# EAGLE design mqtt-LightbulbwithtempandIR (EAGLE 9.6.2)
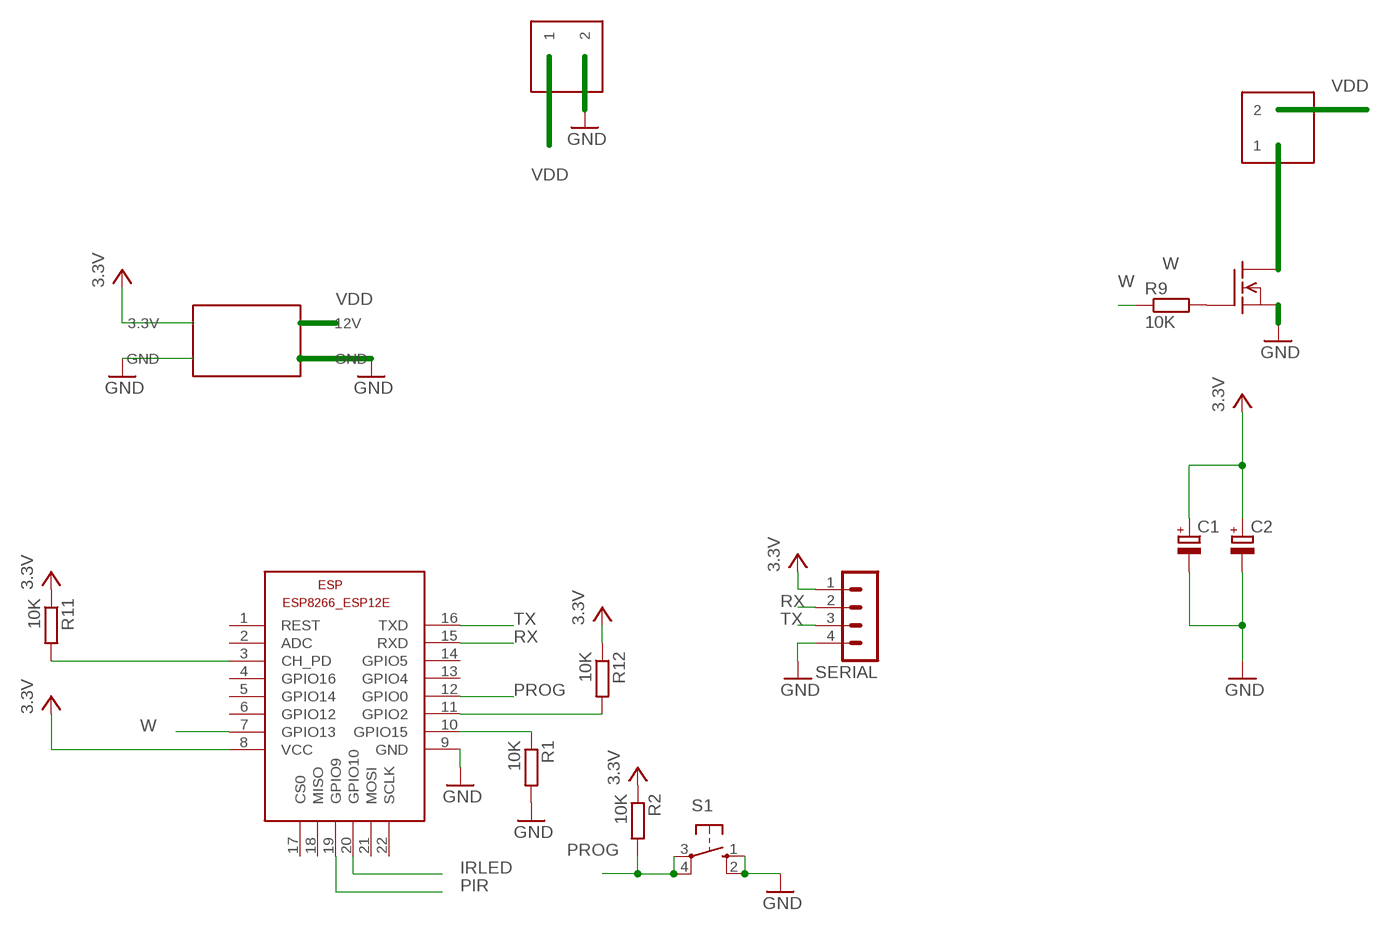
[diagram p0: schematic, sheet 1]

## Parts
C1  CPOL-EUE2-5  [E2-5]
C2  CPOL-EUE2-5  [E2-5]
ESP  ESP8266-12EESP8266-ESP12E  [ESP8266-ESP12E]
PWR1  MP2307-MINI-360  [MP2307-MINI-360]
PWR_IN1  KF350-P2  [KF350-2P]
PWR_IN2  KF350-P2  [KF350-2P]
R1  10K  R-EU_R0603  [R0603]
R2  10K  R-EU_R0603  [R0603]
R9  10K  R-EU_R0603  [R0603]
R11  10K  R-EU_R0603  [R0603]
R12  10K  R-EU_R0603  [R0603]
S1  10-XX  [B3F-10XX]
SERIAL  MA04-1  [MA04-1]
W  FDS5680  [SO-8]

## Nets
DW: PWR_IN1.1 W.5(D) W.6(D) W.7(D) W.8(D)
GND: C1.- C2.- ESP.9(GND) PWR1.GND@1(GND) PWR1.GND@2(GND) PWR_IN2.2 R1.2 S1.1(S) S1.2(S1) SERIAL.4 W.1(S) W.2(S) W.3(S)
IRLED: ESP.20(GPIO10)
N$2: ESP.10(GPIO15) R1.1
N$3: ESP.3(CH_PD) R11.2
N$4: ESP.11(GPIO2) R12.2
N$13: R9.2 W.4(G)
PIR: ESP.19(GPIO9)
PROG: ESP.12(GPIO0) R2.2 S1.3(P) S1.4(P1)
RX: ESP.15(RXD) SERIAL.2
TX: ESP.16(TXD) SERIAL.3
VCC: C1.+ C2.+ ESP.8(VCC) PWR1.3.3V R2.1 R11.1 R12.1 SERIAL.1 ; supply symbol labelled 3.3V
VDD: PWR1.12V PWR_IN1.2 PWR_IN2.1
W: ESP.7(GPIO13) R9.1
Unconnected: ESP.1(REST) ESP.2(ADC) ESP.4(GPIO16) ESP.5(GPIO14) ESP.6(GPIO12) ESP.13(GPIO4) ESP.14(GPIO5) ESP.17(CS0) ESP.18(MISO) ESP.21(MOSI) ESP.22(SCLK)

## Library data of the parts
C1 C2 = resistor:CPOL-EU: POLARIZED CAPACITOR, European symbol
ESP = ESP8266-ESP12E:ESP8266-12E: ESP8266-12E with additional I/O and GPIO04/05 corrected The author cannot warrant that this library is free from error or will meet your specific requirements. Created by PuceBaboon.com. Komagane, Nagano, JAPAN
PWR1 = MP2307-MINI-360:MP2307-MINI-360
PWR_IN1 PWR_IN2 = KF350-P2:KF350-P2
R1 R2 R9 R11 R12 = resistor:R-EU_: RESISTOR, European symbol
S1 = switch-omron:10-XX: OMRON SWITCH; MPN: B3F-1000; OC_FARNELL: 176432; OC_NEWARK: 36M3542
SERIAL = con-lstb:MA04-1: PIN HEADER; OC_FARNELL: unknown; OC_NEWARK: unknown
W = transistor-fet:FDS5680: 60V N-Channel PowerTrench TM MOSFET FAIRCHILD FDS5680.pdf

## Board
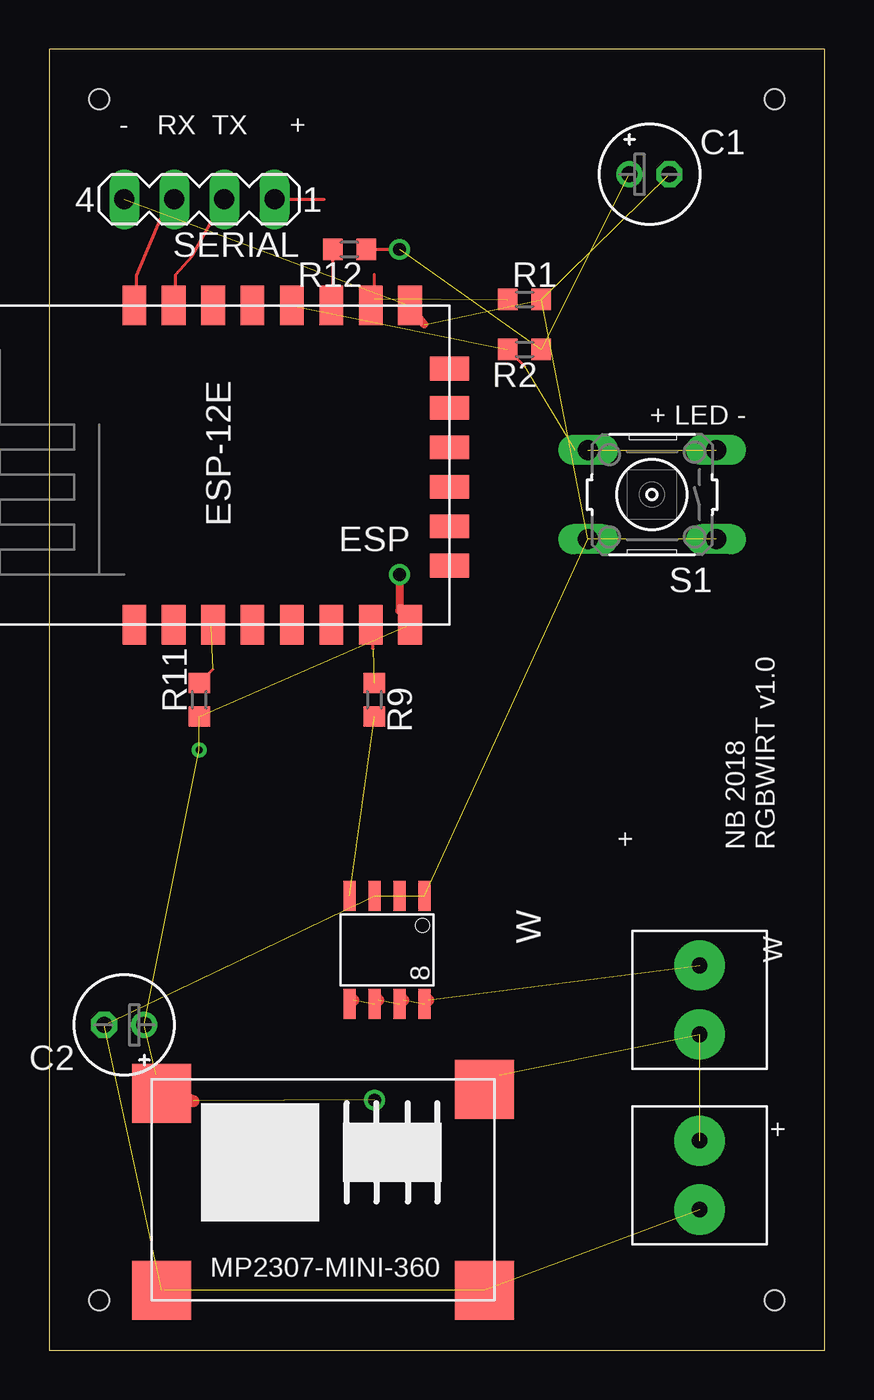
[diagram p1: board, top side]
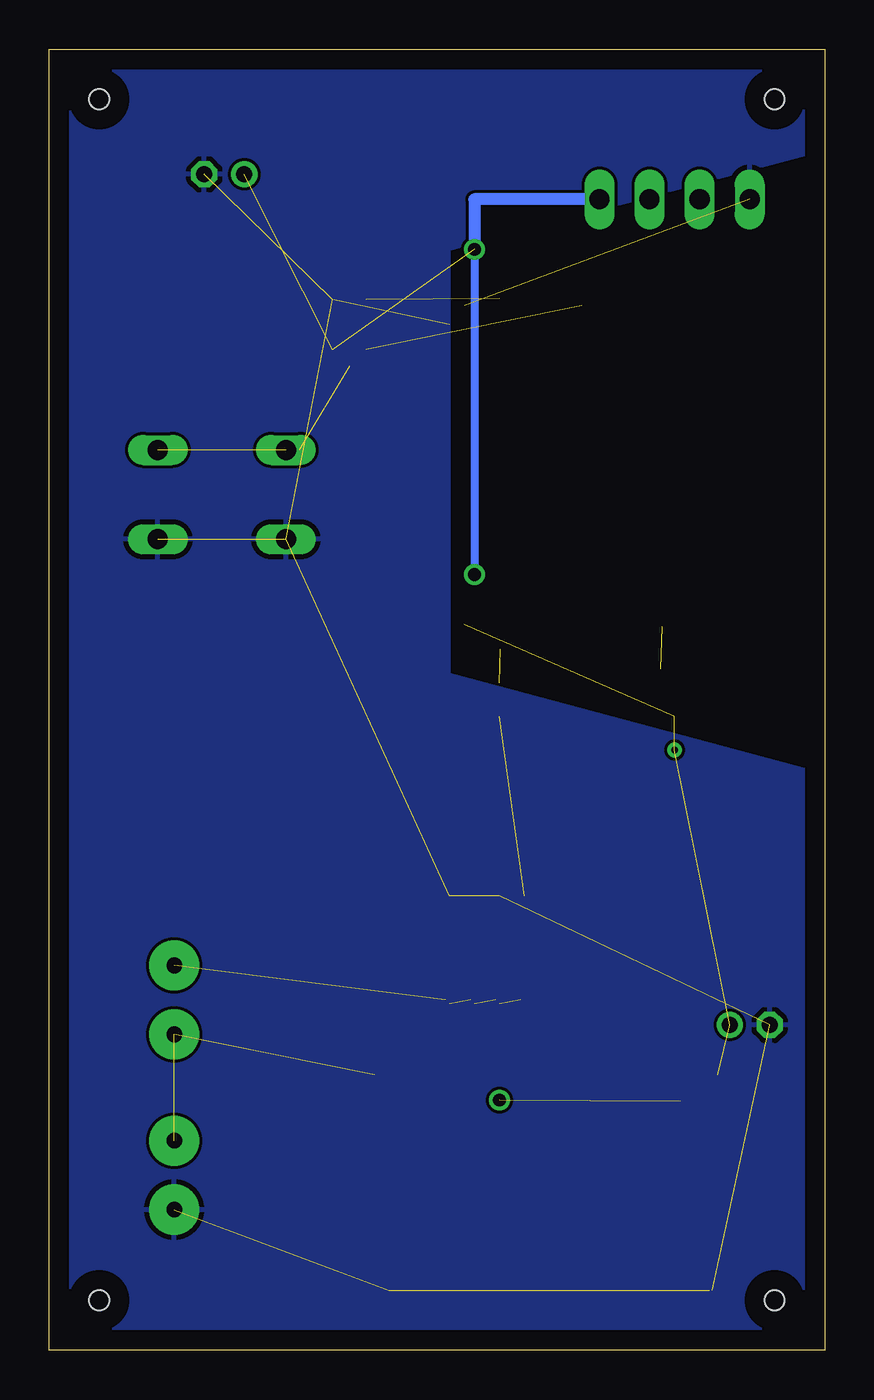
[diagram p2: board, bottom side, seen from below]

Size 39.37 x 66.04 mm. Coordinates in mm from the lower left corner, seen from the top.
Outline: 0,0 39.37,0 39.37,66.04 0,66.03 0,0
Copper layers (1*16): Top 0.035mm / dielectric 1.5mm / Bottom 0.035mm
Design rules "default": minimum track width 6mil, minimum drill 0.35mm, track to track 6mil, track to pad 6mil, pad to pad 6mil, via to via 6mil, smd to smd 6mil, copper to edge 40mil, drill to drill 6mil, minimum pad ring 10mil, minimum via ring 8mil, stop-mask expansion 4mil, vias tented up to drill 0mil, thermal gap 10mil
Holes 1 mm at 2.54,63.5 36.83,63.5 2.54,2.54 36.83,2.54

### Footprints (pad centres in the part's own frame; a part is rotated, then mirrored left to right if it is on the bottom)
E2-5 = drill 0.813 pad 1.27: + -1.016,0 | drill 0.813 pad 1.27 octagon: - 1.016,0
ESP8266-ESP12E = smd 2 x 1.2: 1 -7.62,5.84; 2 -7.62,3.84; 3 -7.62,1.84; 4 -7.62,-0.16; 5 -7.62,-2.16; 6 -7.62,-4.16; 7 -7.62,-6.16; 8 -7.62,-8.16; 9 8.58,-8.16; 10 8.58,-6.16; 11 8.58,-4.16; 12 8.58,-2.16; 13 8.58,-0.16; 14 8.58,1.84; 15 8.58,3.84; 16 8.58,5.84 | smd 1.2 x 2: 17 -4.62,-10.16; 18 -2.62,-10.16; 19 -0.62,-10.16; 20 1.38,-10.16; 21 3.38,-10.16; 22 5.38,-10.16
MP2307-MINI-360 = smd 3 x 3: 3.3V 0.5,10.5; 12V 16.9,10.7; GND@1 16.9,0.5; GND@2 0.5,0.5
KF350-2P = drill 0.8 pad 2.54: 1 -1.75,0; 2 1.75,0
R0603 = smd 1 x 1.1: 1 -0.85,0; 2 0.85,0
B3F-10XX = drill 1.016 long: 1 -3.251,2.261; 2 3.251,2.261; 3 -3.251,-2.261; 4 3.251,-2.261
MA04-1 = drill 1.016 long: 1 -3.81,0; 2 -1.27,0; 3 1.27,0; 4 3.81,0
SO-8 = smd 1.524 x 0.61: 1 -2.743,1.905; 2 -2.743,0.635; 3 -2.743,-0.635; 4 -2.743,-1.905; 5 2.743,-1.905; 6 2.743,-0.635; 7 2.743,0.635; 8 2.743,1.905

### Placement (x,y rotation side)
C1  30.48,59.69 0 top
C2  3.81,16.51 180 top
ESP  10.16,44.45 90 top
PWR1  5.21,2.54 0 top
PWR_IN1  33.02,17.78 270 top
PWR_IN2  33.02,8.89 270 top
R1  24.13,53.34 0 top
R2  24.13,50.8 180 top
R9  16.51,33.02 270 top
R11  7.62,33.02 90 top
R12  15.24,55.88 180 top
S1  30.61,43.43 180 top
SERIAL  7.62,58.42 180 top
W  17.14,20.32 270 top

### Tracks (layer width: path | path; a pad name or v marks a point on that pad's centre or on a via)
DW  (4 unrouted)
  Top 0.61: W.8 19.25,17.78 | W.7 17.98,17.78 | W.6 16.71,17.78 | W.5 15.44,17.78
GND  (12 unrouted)
  Top 0.152: 18.29,53.04 ESP.9
  Top 0.406: ESP.9 19.05,52.07
  Top 0.61: PWR1.GND@2 5.85,3.04
  pour Bottom: 0,66.04 39.37,66.04 39.37,0.32 0,0.32 0,29.21 19.05,34.29 19.05,55.88 0,60.96
N$2  (1 unrouted)
  Top 0.152: 16.46,53.34 16.46,53.04 ESP.10 16.51,53.22 16.51,54.61 | 16.46,53.34 16.46,53.65 | 16.51,53.39 16.46,53.34
N$3  (1 unrouted)
  Top 0.152: ESP.3 8.23,36.73 | R11.2 8.32,34.57
N$4
  Top 0.152: R12.2 14.39,53.1 ESP.11
N$13  (1 unrouted)
PIR
  Top 0.152: 20.27,43.89 ESP.19 20.79,44.3
PROG  (3 unrouted)
  Top 0.152: S1.4 27.94,45.7 26.7,45.7 | R2.2 24.13,49.95
RX
  Top 0.152: ESP.15 6.4,53.04 6.4,54.59 7.26,55.54 SERIAL.2
TX
  Top 0.152: ESP.16 4.42,53.04 4.42,54.56 5.73,57.66 SERIAL.3
VCC  (via drill 0.35, 0.65 pad 0.65)  (7 unrouted)
  Top 0.152: 18.44,36.73 ESP.8 18.44,36.88 | R12.1 v17.78,55.88 | 5.42,13.97 6.35,13.04 | SERIAL.1 13.97,58.42
  Top 0.406: v17.78,39.37 17.78,37.54 18.44,36.88
  Top 0.61: PWR1.3.3V 6.35,13.04 7.33,12.66
  Bottom 0.406: v17.78,55.88 v17.78,39.37
  Bottom 0.61: SERIAL.1 17.78,58.42 v17.78,55.88
  other vias: 16.51,12.7 7.62,30.48
VDD  (2 unrouted)
  Top 0.406: 22.86,13.97 PWR1.12V
W  (1 unrouted)
  Top 0.152: 16.46,35.6 16.41,35.64 16.46,36.73 ESP.7
(copper drawn outside any net)
  shapes: Top area x2

### Text on the board
tPlace: - | RX | TX | + | + LED - | + | NB 2018 / RGBWIRT v1.0 | W | - | +